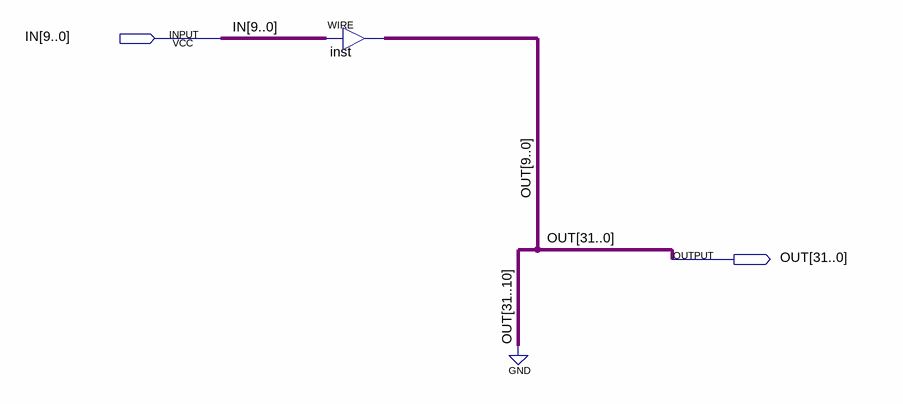
[diagram p0: schematic sheet]
// Quartus schematic ZERO_EXT10.bdf as structural Verilog: 1 symbols, 2 pins
module ZERO_EXT10 (
  input  [9:0] IN,
  output [31:0] OUT
);

  assign OUT[9:0] = IN;  // WIRE inst

  assign OUT[31:10] = {22{1'b0}};
endmodule
